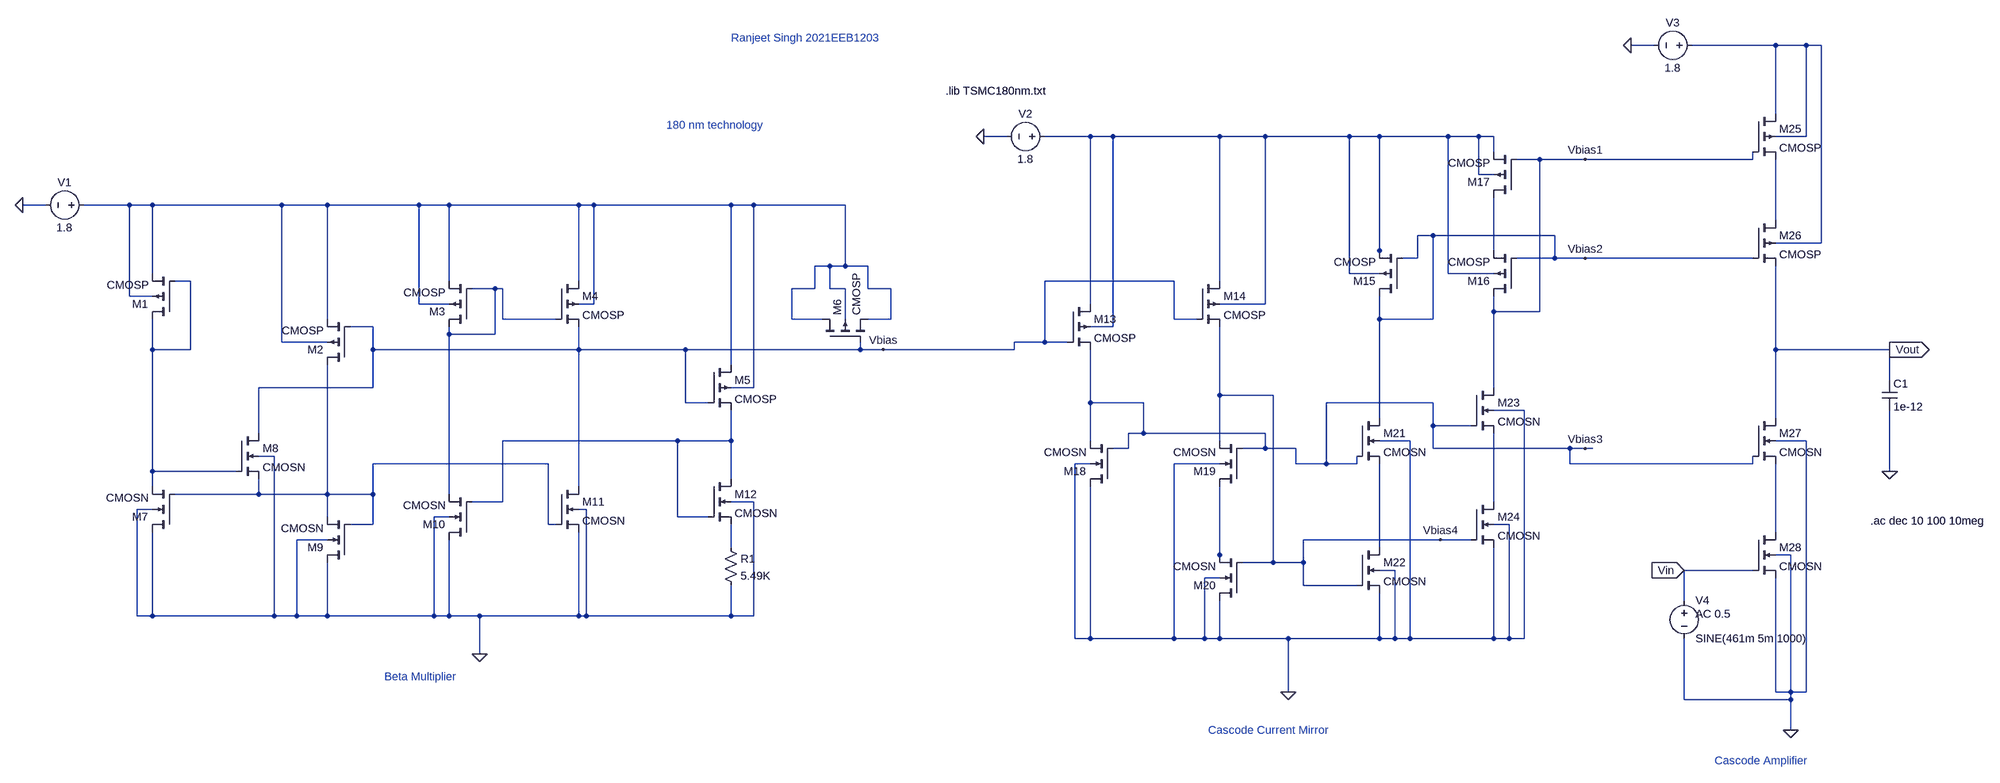
[diagram p0: schematic 180nm.asc]
180nm.asc, the LTspice schematic file:
Version 4
SHEET 1 1832 3152
WIRE 1072 -2384 1024 -2384
WIRE 1328 -2384 1152 -2384
WIRE 1392 -2384 1328 -2384
WIRE 1424 -2384 1392 -2384
WIRE 1328 -2240 1328 -2384
WIRE -288 -2192 -336 -2192
WIRE -112 -2192 -208 -2192
WIRE -64 -2192 -112 -2192
WIRE 160 -2192 -64 -2192
WIRE 256 -2192 160 -2192
WIRE 432 -2192 256 -2192
WIRE 496 -2192 432 -2192
WIRE 640 -2192 496 -2192
WIRE 704 -2192 640 -2192
WIRE 736 -2192 704 -2192
WIRE 1392 -2192 1392 -2384
WIRE 1392 -2192 1328 -2192
WIRE 736 -2160 736 -2192
WIRE 832 -2144 784 -2144
WIRE 928 -2144 832 -2144
WIRE 1280 -2144 1280 -2160
WIRE 1280 -2144 928 -2144
WIRE 704 -2112 704 -2192
WIRE 736 -2112 704 -2112
WIRE -2352 -2048 -2400 -2048
WIRE -2176 -2048 -2272 -2048
WIRE -2128 -2048 -2176 -2048
WIRE -1856 -2048 -2128 -2048
WIRE -1760 -2048 -1856 -2048
WIRE -1568 -2048 -1760 -2048
WIRE -1504 -2048 -1568 -2048
WIRE -1232 -2048 -1504 -2048
WIRE -1200 -2048 -1232 -2048
WIRE -912 -2048 -1200 -2048
WIRE -864 -2048 -912 -2048
WIRE -672 -2048 -864 -2048
WIRE 1328 -2016 1328 -2144
WIRE 608 -1984 576 -1984
WIRE 864 -1984 608 -1984
WIRE 1424 -1968 1424 -2384
WIRE 1424 -1968 1328 -1968
WIRE 496 -1952 496 -2192
WIRE 736 -1952 736 -2064
WIRE 496 -1936 496 -1952
WIRE 576 -1936 576 -1984
WIRE 576 -1936 544 -1936
WIRE 864 -1936 864 -1984
WIRE 864 -1936 784 -1936
WIRE 928 -1936 864 -1936
WIRE 1280 -1936 928 -1936
WIRE -704 -1920 -736 -1920
WIRE -672 -1920 -672 -2048
WIRE -672 -1920 -704 -1920
WIRE -624 -1920 -672 -1920
WIRE -2128 -1904 -2128 -2048
WIRE 432 -1904 432 -2192
WIRE 496 -1904 432 -1904
WIRE 640 -1904 640 -2192
WIRE 736 -1904 640 -1904
WIRE -2048 -1888 -2080 -1888
WIRE -1504 -1888 -1504 -2048
WIRE -1232 -1888 -1232 -2048
WIRE 64 -1888 -208 -1888
WIRE 160 -1888 160 -2192
WIRE -1408 -1872 -1456 -1872
WIRE -1392 -1872 -1408 -1872
WIRE -736 -1872 -736 -1920
WIRE -736 -1872 -784 -1872
WIRE -704 -1872 -704 -1920
WIRE -672 -1872 -704 -1872
WIRE -624 -1872 -624 -1920
WIRE -576 -1872 -624 -1872
WIRE -2176 -1856 -2176 -2048
WIRE -2128 -1856 -2176 -1856
WIRE -1568 -1840 -1568 -2048
WIRE -1504 -1840 -1568 -1840
WIRE -1200 -1840 -1200 -2048
WIRE -1200 -1840 -1232 -1840
WIRE -112 -1840 -112 -2192
WIRE 256 -1840 256 -2192
WIRE 256 -1840 160 -1840
WIRE 736 -1824 736 -1856
WIRE 832 -1824 832 -2144
WIRE 832 -1824 736 -1824
WIRE -1760 -1808 -1760 -2048
WIRE -1392 -1808 -1392 -1872
WIRE -1280 -1808 -1392 -1808
WIRE -784 -1808 -784 -1872
WIRE -720 -1808 -784 -1808
WIRE -672 -1808 -672 -1872
WIRE -576 -1808 -576 -1872
WIRE -576 -1808 -624 -1808
WIRE 64 -1808 64 -1888
WIRE 112 -1808 64 -1808
WIRE 496 -1808 496 -1856
WIRE 608 -1808 608 -1984
WIRE 608 -1808 496 -1808
WIRE -1664 -1792 -1712 -1792
WIRE -64 -1792 -64 -2192
WIRE -64 -1792 -112 -1792
WIRE -1504 -1776 -1504 -1792
WIRE -1408 -1776 -1408 -1872
WIRE -1408 -1776 -1504 -1776
WIRE -1856 -1760 -1856 -2048
WIRE -1760 -1760 -1856 -1760
WIRE -208 -1760 -208 -1888
WIRE -208 -1760 -272 -1760
WIRE -160 -1760 -208 -1760
WIRE -2128 -1744 -2128 -1808
WIRE -2048 -1744 -2048 -1888
WIRE -2048 -1744 -2128 -1744
WIRE -1664 -1744 -1664 -1792
WIRE -1232 -1744 -1232 -1792
WIRE -1232 -1744 -1664 -1744
WIRE -1008 -1744 -1232 -1744
WIRE -640 -1744 -640 -1760
WIRE -640 -1744 -1008 -1744
WIRE -592 -1744 -640 -1744
WIRE -272 -1744 -272 -1760
WIRE -272 -1744 -592 -1744
WIRE 1328 -1744 1328 -1920
WIRE 1616 -1744 1328 -1744
WIRE -912 -1712 -912 -2048
WIRE 1616 -1680 1616 -1744
WIRE -1664 -1664 -1664 -1744
WIRE -1664 -1664 -1904 -1664
WIRE -864 -1664 -864 -2048
WIRE -864 -1664 -912 -1664
WIRE 736 -1664 736 -1824
WIRE 160 -1648 160 -1792
WIRE 272 -1648 160 -1648
WIRE -1008 -1632 -1008 -1744
WIRE -960 -1632 -1008 -1632
WIRE -112 -1632 -112 -1744
WIRE 0 -1632 -112 -1632
WIRE 608 -1632 384 -1632
WIRE 800 -1616 736 -1616
WIRE 496 -1600 496 -1808
WIRE 1328 -1600 1328 -1744
WIRE 608 -1584 608 -1632
WIRE 688 -1584 608 -1584
WIRE -1904 -1568 -1904 -1664
WIRE 0 -1568 0 -1632
WIRE 0 -1568 -32 -1568
WIRE 256 -1568 0 -1568
WIRE -1024 -1552 -1392 -1552
WIRE -912 -1552 -912 -1616
WIRE -912 -1552 -1024 -1552
WIRE -112 -1552 -112 -1632
WIRE 160 -1552 160 -1648
WIRE 560 -1552 496 -1552
WIRE 1392 -1552 1328 -1552
WIRE -32 -1536 -32 -1568
WIRE -32 -1536 -64 -1536
WIRE 256 -1536 256 -1568
WIRE 256 -1536 208 -1536
WIRE 320 -1536 256 -1536
WIRE 608 -1536 608 -1584
WIRE 896 -1536 608 -1536
WIRE 928 -1536 896 -1536
WIRE 944 -1536 928 -1536
WIRE -1872 -1520 -1904 -1520
WIRE -1296 -1504 -1664 -1504
WIRE -112 -1504 -144 -1504
WIRE 160 -1504 64 -1504
WIRE 320 -1504 320 -1536
WIRE 384 -1504 384 -1632
WIRE 384 -1504 320 -1504
WIRE 448 -1504 448 -1520
WIRE 448 -1504 384 -1504
WIRE 896 -1504 896 -1536
WIRE 1280 -1504 1280 -1520
WIRE 1280 -1504 896 -1504
WIRE -2128 -1488 -2128 -1744
WIRE -1952 -1488 -2128 -1488
WIRE 1616 -1488 1616 -1616
WIRE -912 -1472 -912 -1552
WIRE -2128 -1456 -2128 -1488
WIRE -1232 -1456 -1232 -1744
WIRE -1904 -1440 -1904 -1472
WIRE -1904 -1440 -2080 -1440
WIRE -1760 -1440 -1760 -1712
WIRE -1760 -1440 -1904 -1440
WIRE -1664 -1440 -1664 -1504
WIRE -1664 -1440 -1760 -1440
WIRE -1504 -1440 -1504 -1776
WIRE -1392 -1424 -1392 -1552
WIRE -1392 -1424 -1456 -1424
WIRE -864 -1424 -912 -1424
WIRE 736 -1424 736 -1568
WIRE -2128 -1408 -2160 -1408
WIRE -1216 -1408 -1232 -1408
WIRE -1760 -1392 -1760 -1440
WIRE -1504 -1392 -1536 -1392
WIRE -1024 -1392 -1024 -1552
WIRE -960 -1392 -1024 -1392
WIRE -1664 -1376 -1664 -1440
WIRE -1664 -1376 -1712 -1376
WIRE -1296 -1376 -1296 -1504
WIRE -1280 -1376 -1296 -1376
WIRE 768 -1376 736 -1376
WIRE 1328 -1360 1328 -1504
WIRE -1760 -1344 -1824 -1344
WIRE 624 -1344 336 -1344
WIRE 688 -1344 624 -1344
WIRE -912 -1328 -912 -1376
WIRE 496 -1328 496 -1504
WIRE 160 -1312 160 -1456
WIRE 1360 -1312 1328 -1312
WIRE 160 -1296 160 -1312
WIRE 272 -1296 272 -1648
WIRE 272 -1296 208 -1296
WIRE 336 -1296 336 -1344
WIRE 336 -1296 272 -1296
WIRE 528 -1280 496 -1280
WIRE 1280 -1280 1136 -1280
WIRE 160 -1264 128 -1264
WIRE 336 -1248 336 -1296
WIRE 448 -1248 336 -1248
WIRE 1136 -1216 1136 -1280
WIRE -2160 -1184 -2160 -1408
WIRE -2128 -1184 -2128 -1360
WIRE -2128 -1184 -2160 -1184
WIRE -1872 -1184 -1872 -1520
WIRE -1872 -1184 -2128 -1184
WIRE -1824 -1184 -1824 -1344
WIRE -1824 -1184 -1872 -1184
WIRE -1760 -1184 -1760 -1296
WIRE -1760 -1184 -1824 -1184
WIRE -1536 -1184 -1536 -1392
WIRE -1536 -1184 -1760 -1184
WIRE -1504 -1184 -1504 -1344
WIRE -1504 -1184 -1536 -1184
WIRE -1440 -1184 -1504 -1184
WIRE -1232 -1184 -1232 -1360
WIRE -1232 -1184 -1440 -1184
WIRE -1216 -1184 -1216 -1408
WIRE -1216 -1184 -1232 -1184
WIRE -912 -1184 -912 -1248
WIRE -912 -1184 -1216 -1184
WIRE -864 -1184 -864 -1424
WIRE -864 -1184 -912 -1184
WIRE -144 -1136 -144 -1504
WIRE -112 -1136 -112 -1456
WIRE -112 -1136 -144 -1136
WIRE 64 -1136 64 -1504
WIRE 64 -1136 -112 -1136
WIRE 128 -1136 128 -1264
WIRE 128 -1136 64 -1136
WIRE 160 -1136 160 -1216
WIRE 160 -1136 128 -1136
WIRE 304 -1136 160 -1136
WIRE 496 -1136 496 -1232
WIRE 496 -1136 304 -1136
WIRE 528 -1136 528 -1280
WIRE 528 -1136 496 -1136
WIRE 560 -1136 560 -1552
WIRE 560 -1136 528 -1136
WIRE 736 -1136 736 -1328
WIRE 736 -1136 560 -1136
WIRE 768 -1136 768 -1376
WIRE 768 -1136 736 -1136
WIRE 800 -1136 800 -1616
WIRE 800 -1136 768 -1136
WIRE -1440 -1104 -1440 -1184
WIRE 304 -1024 304 -1136
WIRE 1328 -1024 1328 -1264
WIRE 1360 -1024 1360 -1312
WIRE 1360 -1024 1328 -1024
WIRE 1392 -1024 1392 -1552
WIRE 1392 -1024 1360 -1024
WIRE 1136 -1008 1136 -1136
WIRE 1360 -1008 1360 -1024
WIRE 1360 -1008 1136 -1008
WIRE 1360 -944 1360 -1008
FLAG -592 -1744 Vbias
FLAG -2400 -2048 0
FLAG -336 -2192 0
FLAG 304 -1024 0
FLAG -1440 -1104 0
FLAG 928 -2144 Vbias1
FLAG 928 -1936 Vbias2
FLAG 928 -1536 Vbias3
FLAG 624 -1344 Vbias4
FLAG 1024 -2384 0
FLAG 1616 -1488 0
FLAG 1360 -944 0
FLAG 1616 -1744 Vout
IOPIN 1616 -1744 Out
FLAG 1136 -1280 Vin
IOPIN 1136 -1280 In
DATAFLAG 1088 -1504 ""
DATAFLAG 1104 -1936 ""
DATAFLAG 1120 -2144 ""
DATAFLAG -464 -1744 ""
DATAFLAG 1328 -2064 ""
DATAFLAG 1328 -2272 ""
DATAFLAG 1328 -1840 ""
DATAFLAG 1328 -1424 ""
DATAFLAG 1328 -1200 ""
DATAFLAG 1184 -1280 ""
DATAFLAG 384 -1344 ""
SYMBOL pmos4 -2080 -1808 R180
SYMATTR InstName M1
SYMATTR Value CMOSP
SYMATTR Value2 l=20 w=10
SYMBOL pmos4 -1712 -1712 R180
SYMATTR InstName M2
SYMATTR Value CMOSP
SYMATTR Value2 l=2 w=24
SYMBOL pmos4 -1456 -1792 R180
SYMATTR InstName M3
SYMATTR Value CMOSP
SYMATTR Value2 l=2 w=24
SYMBOL pmos4 -1280 -1888 R0
SYMATTR InstName M4
SYMATTR Value CMOSP
SYMATTR Value2 l=2 w=24
SYMBOL pmos4 -960 -1712 R0
SYMATTR InstName M5
SYMATTR Value CMOSP
SYMATTR Value2 l=2 w=24
SYMBOL pmos4 -720 -1760 R270
SYMATTR InstName M6
SYMATTR Value CMOSP
SYMATTR Value2 l=50 w=50
SYMBOL nmos4 -2080 -1360 R180
SYMATTR InstName M7
SYMATTR Value CMOSN
SYMATTR Value2 l=2 w=10
SYMBOL nmos4 -1952 -1568 R0
SYMATTR InstName M8
SYMATTR Value CMOSN
SYMATTR Value2 l=2 w=4
SYMBOL nmos4 -1712 -1296 R180
SYMATTR InstName M9
SYMATTR Value CMOSN
SYMATTR Value2 l=2 w=10
SYMBOL nmos4 -1456 -1344 R180
SYMATTR InstName M10
SYMATTR Value CMOSN
SYMATTR Value2 l=2 w=10
SYMBOL nmos4 -1280 -1456 R0
SYMATTR InstName M11
SYMATTR Value CMOSN
SYMATTR Value2 l=2 w=10
SYMBOL nmos4 -960 -1472 R0
SYMATTR InstName M12
SYMATTR Value CMOSN
SYMATTR Value2 l=2 w=30
SYMBOL res -928 -1344 R0
SYMATTR InstName R1
SYMATTR Value 5.49K
SYMATTR SpiceLine tol=1 pwr=0.1
SYMBOL voltage -2256 -2048 R90
WINDOW 0 -32 56 VBottom 2
WINDOW 3 32 56 VTop 2
WINDOW 123 0 0 Left 0
WINDOW 39 0 0 Left 0
SYMATTR InstName V1
SYMATTR Value 1.8
SYMBOL pmos4 -160 -1840 R0
SYMATTR InstName M13
SYMATTR Value CMOSP
SYMATTR Value2 l=2 w=24
SYMBOL pmos4 112 -1888 R0
SYMATTR InstName M14
SYMATTR Value CMOSP
SYMATTR Value2 l=2 w=24
SYMBOL pmos4 544 -1856 R180
SYMATTR InstName M15
SYMATTR Value CMOSP
SYMATTR Value2 l=5 w=20
SYMBOL pmos4 784 -1856 R180
SYMATTR InstName M16
SYMATTR Value CMOSP
SYMATTR Value2 l=2 w=24
SYMBOL pmos4 784 -2064 R180
SYMATTR InstName M17
SYMATTR Value CMOSP
SYMATTR Value2 l=2 w=24
SYMBOL nmos4 -64 -1456 R180
SYMATTR InstName M18
SYMATTR Value CMOSN
SYMATTR Value2 l=2 w=5
SYMBOL nmos4 208 -1456 R180
SYMATTR InstName M19
SYMATTR Value CMOSN
SYMATTR Value2 l=2 w=10
SYMBOL nmos4 208 -1216 R180
SYMATTR InstName M20
SYMATTR Value CMOSN
SYMATTR Value2 l=2 w=10
SYMBOL nmos4 448 -1600 R0
SYMATTR InstName M21
SYMATTR Value CMOSN
SYMATTR Value2 l=2 w=10
SYMBOL nmos4 448 -1328 R0
SYMATTR InstName M22
SYMATTR Value CMOSN
SYMATTR Value2 l=2 w=10
SYMBOL nmos4 688 -1664 R0
SYMATTR InstName M23
SYMATTR Value CMOSN
SYMATTR Value2 l=2 w=10
SYMBOL nmos4 688 -1424 R0
SYMATTR InstName M24
SYMATTR Value CMOSN
SYMATTR Value2 l=2 w=10
SYMBOL voltage -192 -2192 R90
WINDOW 0 -32 56 VBottom 2
WINDOW 3 32 56 VTop 2
WINDOW 123 0 0 Left 0
WINDOW 39 0 0 Left 0
SYMATTR InstName V2
SYMATTR Value 1.8
SYMBOL pmos4 1280 -2240 R0
SYMATTR InstName M25
SYMATTR Value CMOSP
SYMATTR Value2 l=360n w=460n
SYMBOL pmos4 1280 -2016 R0
SYMATTR InstName M26
SYMATTR Value CMOSP
SYMATTR Value2 l=360n w=1620n
SYMBOL nmos4 1280 -1600 R0
SYMATTR InstName M27
SYMATTR Value CMOSN
SYMATTR Value2 l=360n w=1920n
SYMBOL nmos4 1280 -1360 R0
SYMATTR InstName M28
SYMATTR Value CMOSN
SYMATTR Value2 l=360n w=1480n
SYMBOL cap 1600 -1680 R0
SYMATTR InstName C1
SYMATTR Value 1e-12
SYMBOL voltage 1168 -2384 R90
WINDOW 0 -32 56 VBottom 2
WINDOW 3 32 56 VTop 2
WINDOW 123 0 0 Left 0
WINDOW 39 0 0 Left 0
SYMATTR InstName V3
SYMATTR Value 1.8
SYMBOL voltage 1136 -1232 R0
WINDOW 123 24 44 Left 2
WINDOW 39 0 0 Left 0
SYMATTR Value2 AC 0.5
SYMATTR InstName V4
SYMATTR Value SINE(461m 5m 1000)
TEXT -1048 -2216 Left 2 ;180 nm technology
TEXT -416 -2288 Left 2 !.lib TSMC180nm.txt
TEXT 1576 -1384 Left 2 !.ac dec 10 100 10meg
TEXT -1640 -1056 Left 2 ;Beta Multiplier
TEXT -912 -2400 Left 2 ;Ranjeet Singh 2021EEB1203
TEXT 136 -944 Left 2 ;Cascode Current Mirror
TEXT 1200 -880 Left 2 ;Cascode Amplifier

The netlist it stands for:
* 180nm.asc
M1 N006 N006 N003 N003 CMOSP l=20 w=10
M2 N009 Vbias N003 N003 CMOSP l=2 w=24
M3 N007 N007 N003 N003 CMOSP l=2 w=24
M4 N003 N007 Vbias N003 CMOSP l=2 w=24
M5 N003 Vbias N008 N003 CMOSP l=2 w=24
M6 N003 Vbias N003 N003 CMOSP l=50 w=50
M7 0 N009 N006 0 CMOSN l=2 w=10
M8 Vbias N006 N009 0 CMOSN l=2 w=4
M9 0 N009 N009 0 CMOSN l=2 w=10
M10 0 N008 N007 0 CMOSN l=2 w=10
M11 Vbias N009 0 0 CMOSN l=2 w=10
M12 N008 N008 N012 0 CMOSN l=2 w=30
R1 N012 0 5.49K tol=1 pwr=0.1
V1 N003 0 1.8
M13 N002 Vbias Vbias3 N002 CMOSP l=2 w=24
M14 N002 Vbias Vbias4 N002 CMOSP l=2 w=24
M15 Vbias2 Vbias2 N002 N002 CMOSP l=5 w=20
M16 Vbias1 Vbias2 N005 N002 CMOSP l=2 w=24
M17 N005 Vbias1 N002 N002 CMOSP l=2 w=24
M18 0 Vbias3 Vbias3 0 CMOSN l=2 w=5
M19 N014 Vbias3 Vbias4 0 CMOSN l=2 w=10
M20 0 Vbias4 N014 0 CMOSN l=2 w=10
M21 Vbias2 Vbias3 N013 0 CMOSN l=2 w=10
M22 N013 Vbias4 0 0 CMOSN l=2 w=10
M23 Vbias1 Vbias3 N010 0 CMOSN l=2 w=10
M24 N010 Vbias4 0 0 CMOSN l=2 w=10
V2 N002 0 1.8
M25 N001 Vbias1 N004 N001 CMOSP l=360n w=460n
M26 N004 Vbias2 Vout N001 CMOSP l=360n w=1620n
M27 Vout Vbias3 N011 0 CMOSN l=360n w=1920n
M28 N011 Vin 0 0 CMOSN l=360n w=1480n
C1 Vout 0 1e-12
V3 N001 0 1.8
V4 Vin 0 SINE(461m 5m 1000) AC 0.5
.model NMOS NMOS
.model PMOS PMOS
.lib standard.mos
* 180 nm technology
.lib TSMC180nm.txt
.ac dec 10 100 10meg
* Beta Multiplier
* Ranjeet Singh 2021EEB1203
* Cascode Current Mirror
* Cascode Amplifier
.backanno
.end